# EAGLE design adns600_board_2k11 (EAGLE 5.06)
REF_FN: 1466611
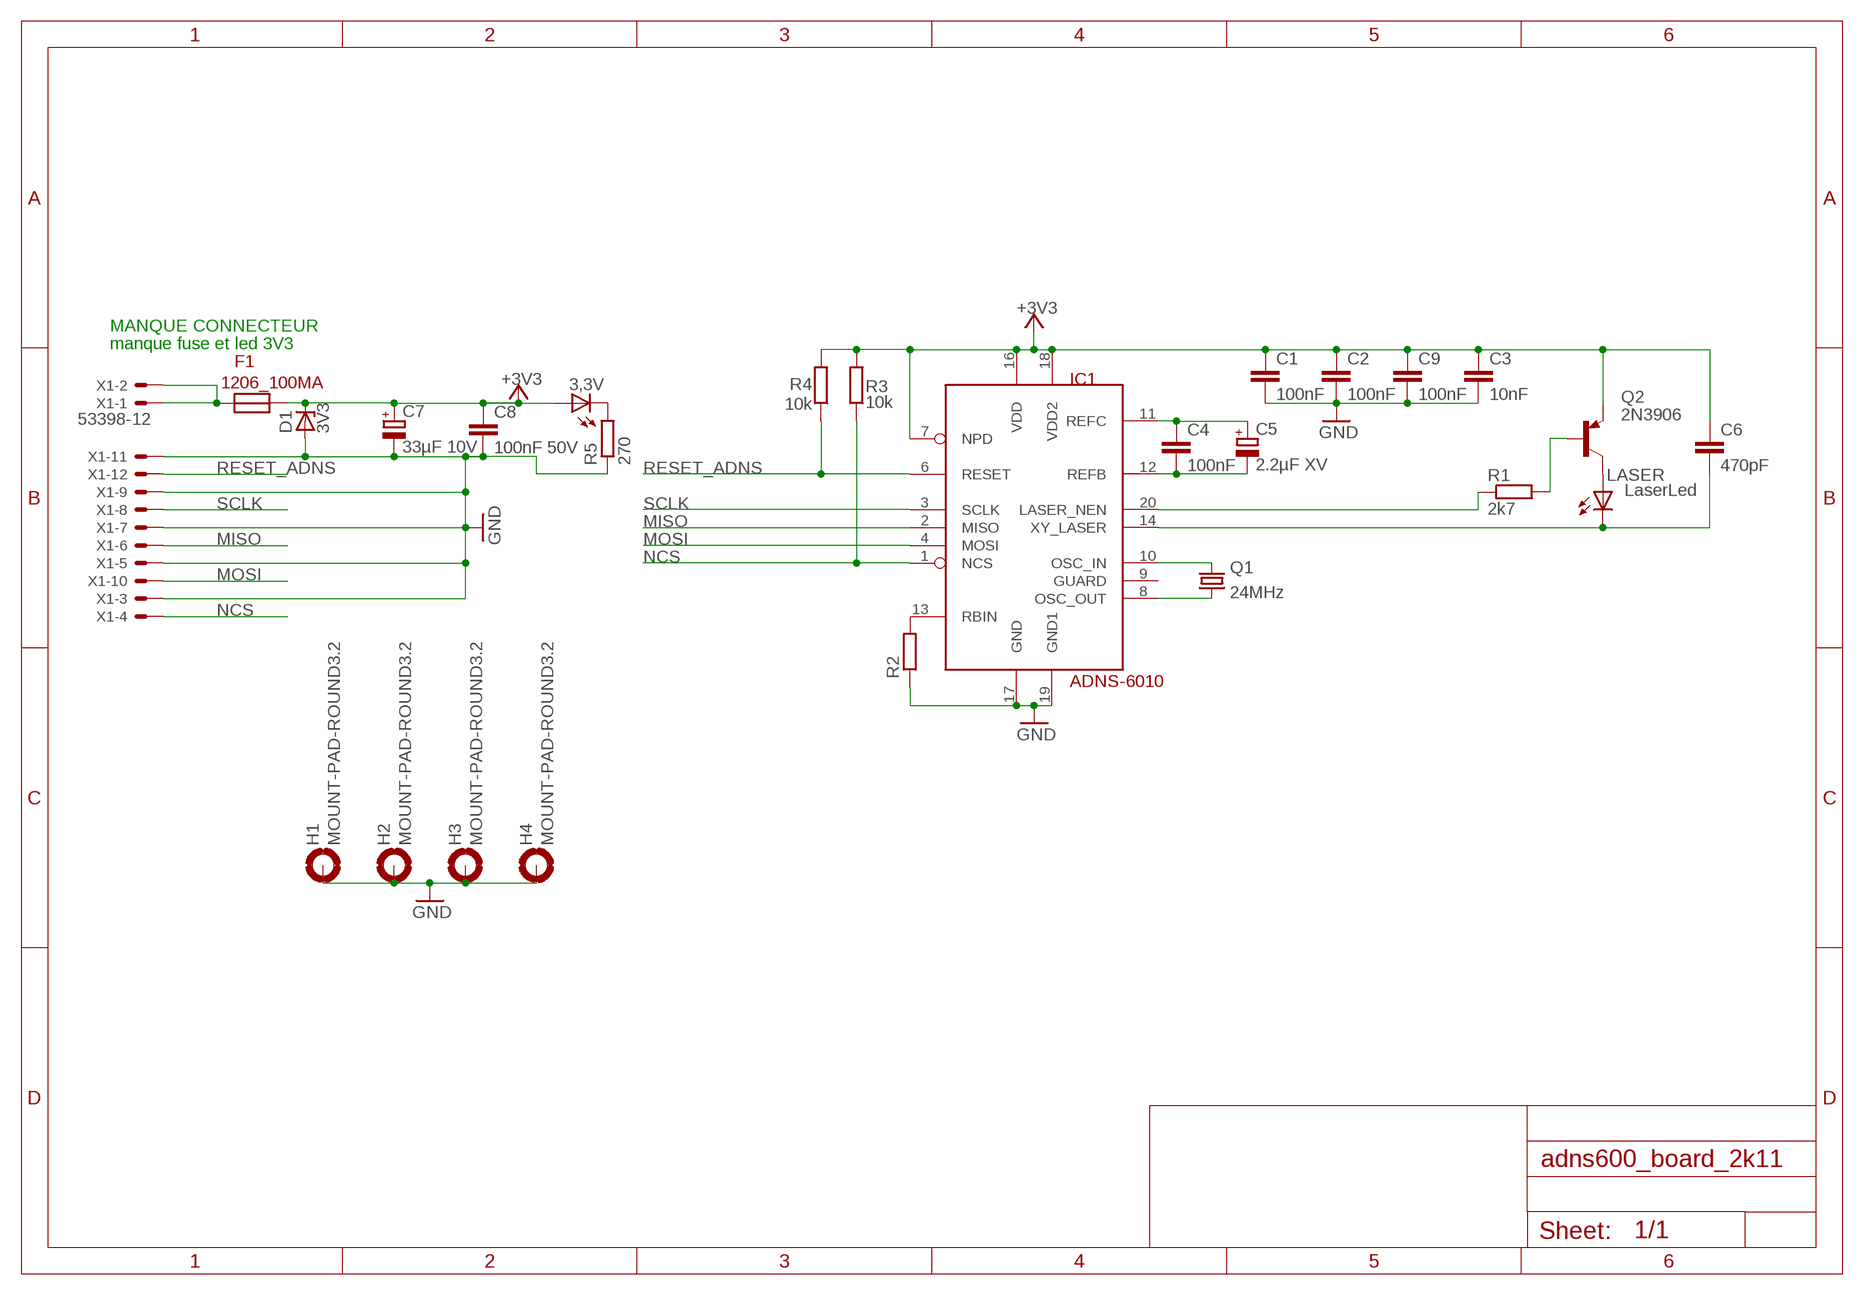
[diagram p0: schematic, sheet 1]

## Parts
3,3V  LEDCHIPLED_0805  [CHIPLED_0805]
C1  100nF  C-EUC0805  [C0805]
C2  100nF  C-EUC0805  [C0805]
C3  10nF  C-EUC0805  [C0805]
C4  100nF  C-EUC0805  [C0805]
C5  2.2µF XV  CPOL-EUSMCA  [SMC_A]
C6  470pF  C-EUC0805  [C0805]
C7  33µF 10V  CPOL-EUSMCC  [SMC_C]
C8  100nF 50V  C-EUC0805  [C0805]
C9  100nF  C-EUC0805  [C0805]
D1  3V3  ZENER-DIODESOT23  [SOT23]
F1  1206_100MA  [R1206W]
H1  MOUNT-PAD-ROUND3.2  [3,2-PAD]
H2  MOUNT-PAD-ROUND3.2  [3,2-PAD]
H3  MOUNT-PAD-ROUND3.2  [3,2-PAD]
H4  MOUNT-PAD-ROUND3.2  [3,2-PAD]
IC1  ADNS-6010  [ADNS-6010]
LASER  LaserLed  LED3MM  [LED3MM]
Q1  24MHz  CRYSTALSM49  [SM49]
Q2  2N3906  [TO92]
R1  2k7  R-EU_R0805  [R0805]
R2  R-EU_R0805  [R0805]
R3  10k  R-EU_R0805  [R0805]
R4  10k  R-EU_R0805  [R0805]
R5  270  R-EU_R0805  [R0805]
X1  53398-12  [53398-12]

## Nets
+3V3: 3,3V.A C1.1 C2.1 C3.1 C6.1 C7.+ C8.1 C9.1 D1.3(C) F1.2 IC1.7(NPD) IC1.16(VDD) IC1.18(VDD2) Q2.3(E) R3.2 R4.2
GND: C1.2 C2.2 C3.2 C7.- C8.2 C9.2 D1.1(A) H1.B3,2(MOUNT) H2.B3,2(MOUNT) H3.B3,2(MOUNT) H4.B3,2(MOUNT) IC1.17(GND) IC1.19(GND1) R2.1 R5.1 X1.3 X1.5 X1.7 X1.9 X1.11
MISO: IC1.2(MISO) X1.6
MOSI: IC1.4(MOSI) X1.10
N$1: IC1.10(OSC_IN) Q1.2
N$2: C4.1 C5.+ IC1.11(REFC)
N$3: C4.2 C5.- IC1.12(REFB)
N$4: IC1.8(OSC_OUT) Q1.1
N$5: Q2.2(B) R1.2
N$6: IC1.13(RBIN) R2.2
N$8: 3,3V.C R5.2
N$9: F1.1 X1.1 X1.2
N$13: IC1.20(LASER_NEN) R1.1
N$14: LASER.A Q2.1(C)
N$15: C6.2 IC1.14(XY_LASER) LASER.K(C)
NCS: IC1.1(NCS) R3.1 X1.4
RESET_ADNS: IC1.6(RESET) R4.1 X1.12
SCLK: IC1.3(SCLK) X1.8
Unconnected: IC1.9(GUARD)

## Notes on the sheet
- MANQUE CONNECTEUR
- manque fuse et led 3V3

## Library data of the parts
3,3V LASER = led:LED: LED OSRAM: - CHIPLED LG R971, LG N971, LY N971, LG Q971, LY Q971, LO R971, LY R971 LH N974, LH R974 LS Q976, LO Q976, LY Q976 LO Q996 - Hyper CHIPLED LW Q18S LB Q993, LB Q99A, LB R99A - SideLED LS A670, LO A670, LY A670, LG A670, LP A670 LB A673, LV A673, LT A673, LW A673 LH A674 LY A675 LS A676, LA A676, LO A676, LY A676, LW A676 LS A679, LY A679, LG A679 - Hyper Micro SIDELED® LS Y876, LA Y876, LO Y876, LY Y876 LT Y87S - SmartLED LW L88C, LW L88S LB L89C, LB L89S, LG L890 LS L89K, LO L89K, LY L89K LS L896, LA L896, LO L896, LY L896 - TOPLED LS T670, LO T670, LY T670, LG T670, LP T670 LSG T670, LSP T670, LSY T670, LOP T670, LYG T670 LG T671, LOG T671, LSG T671 LB T673, LV T673, LT T673, LW T673 LH T674 LS T676, LA T676, LO T676, LY T676, LB T676, LH T676, LSB T676, LW T676 LB T67C, LV T67C, LT T67C, LS T67K, LO T67K, LY T67K, LW E67C LS E67B, LA E67B, LO E67B, LY E67B, LB E67C, LV E67C, LT E67C LW T67C LS T679, LY T679, LG T679 LS T770, LO T770, LY T770, LG T770, LP T770 LB T773, LV T773, LT T773, LW T773 LH T774 LS E675, LA E675, LY E675, LS T675 LS T776, LA T776, LO T776, LY T776, LB T776 LHGB T686 LT T68C, LB T68C - Hyper Mini TOPLED® LB M676 - Mini TOPLED Santana® LG M470 LS M47K, LO M47K, LY M47K Source: http://www.osram.convergy.de LUXEON: - LUMILED® LXK2-PW12-R00, LXK2-PW12-S00, LXK2-PW14-U00, LXK2-PW14-V00 LXK2-PM12-R00, LXK2-PM12-S00, LXK2-PM14-U00 LXK2-PE12-Q00, LXK2-PE12-R00, LXK2-PE12-S00, LXK2-PE14-T00, LXK2-PE14-U00 LXK2-PB12-K00, LXK2-PB12-L00, LXK2-PB12-M00, LXK2-PB14-N00, LXK2-PB14-P00, LXK2-PB14-Q00 LXK2-PR12-L00, LXK2-PR12-M00, LXK2-PR14-Q00, LXK2-PR14-R00 LXK2-PD12-Q00, LXK2-PD12-R00, LXK2-PD12-S00 LXK2-PH12-R00, LXK2-PH12-S00 LXK2-PL12-P00, LXK2-PL12-Q00, LXK2-PL12-R00 Source: www.luxeon.com KINGBRIGHT: KA-3528ASYC Source: www.kingbright.com
C1-C4 C6 C8 C9 = rcl:C-EU: CAPACITOR, European symbol
C5 C7 = rcl:CPOL-EU: POLARIZED CAPACITOR, European symbol
D1 = diode:ZENER-DIODE: Z-Diode
F1 = robotter_fuses:1206_100MA; REF_FN: 1596521
H1-H4 = holes:MOUNT-PAD-ROUND: MOUNTING PAD, round
IC1 = robotter:ADNS-6010
Q1 = crystal:CRYSTAL: CRYSTAL
Q2 = transistor-pnp:2N3906: PNP Transistor
R1-R5 = rcl:R-EU_: RESISTOR, European symbol
X1 = con-molex:53?-12: CONNECTOR wire to board 1.25 mm (.049 inch) pitch header

## Board
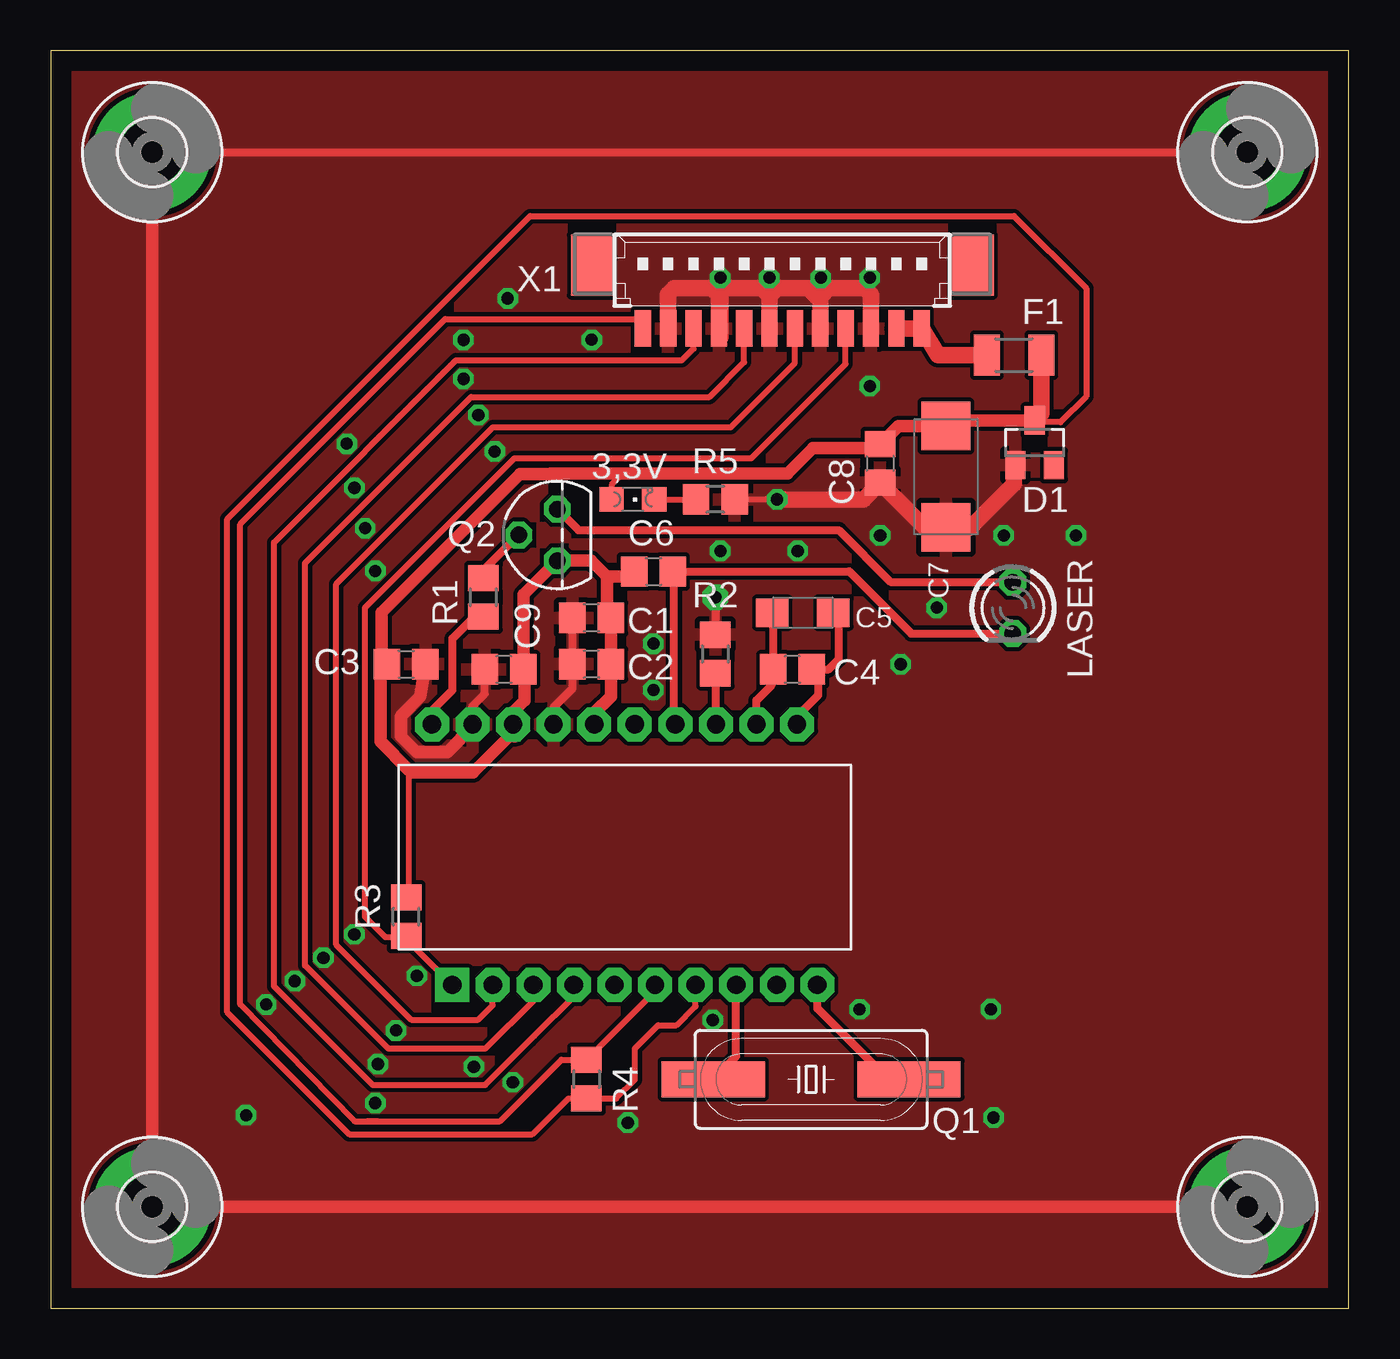
[diagram p1: board, top side]
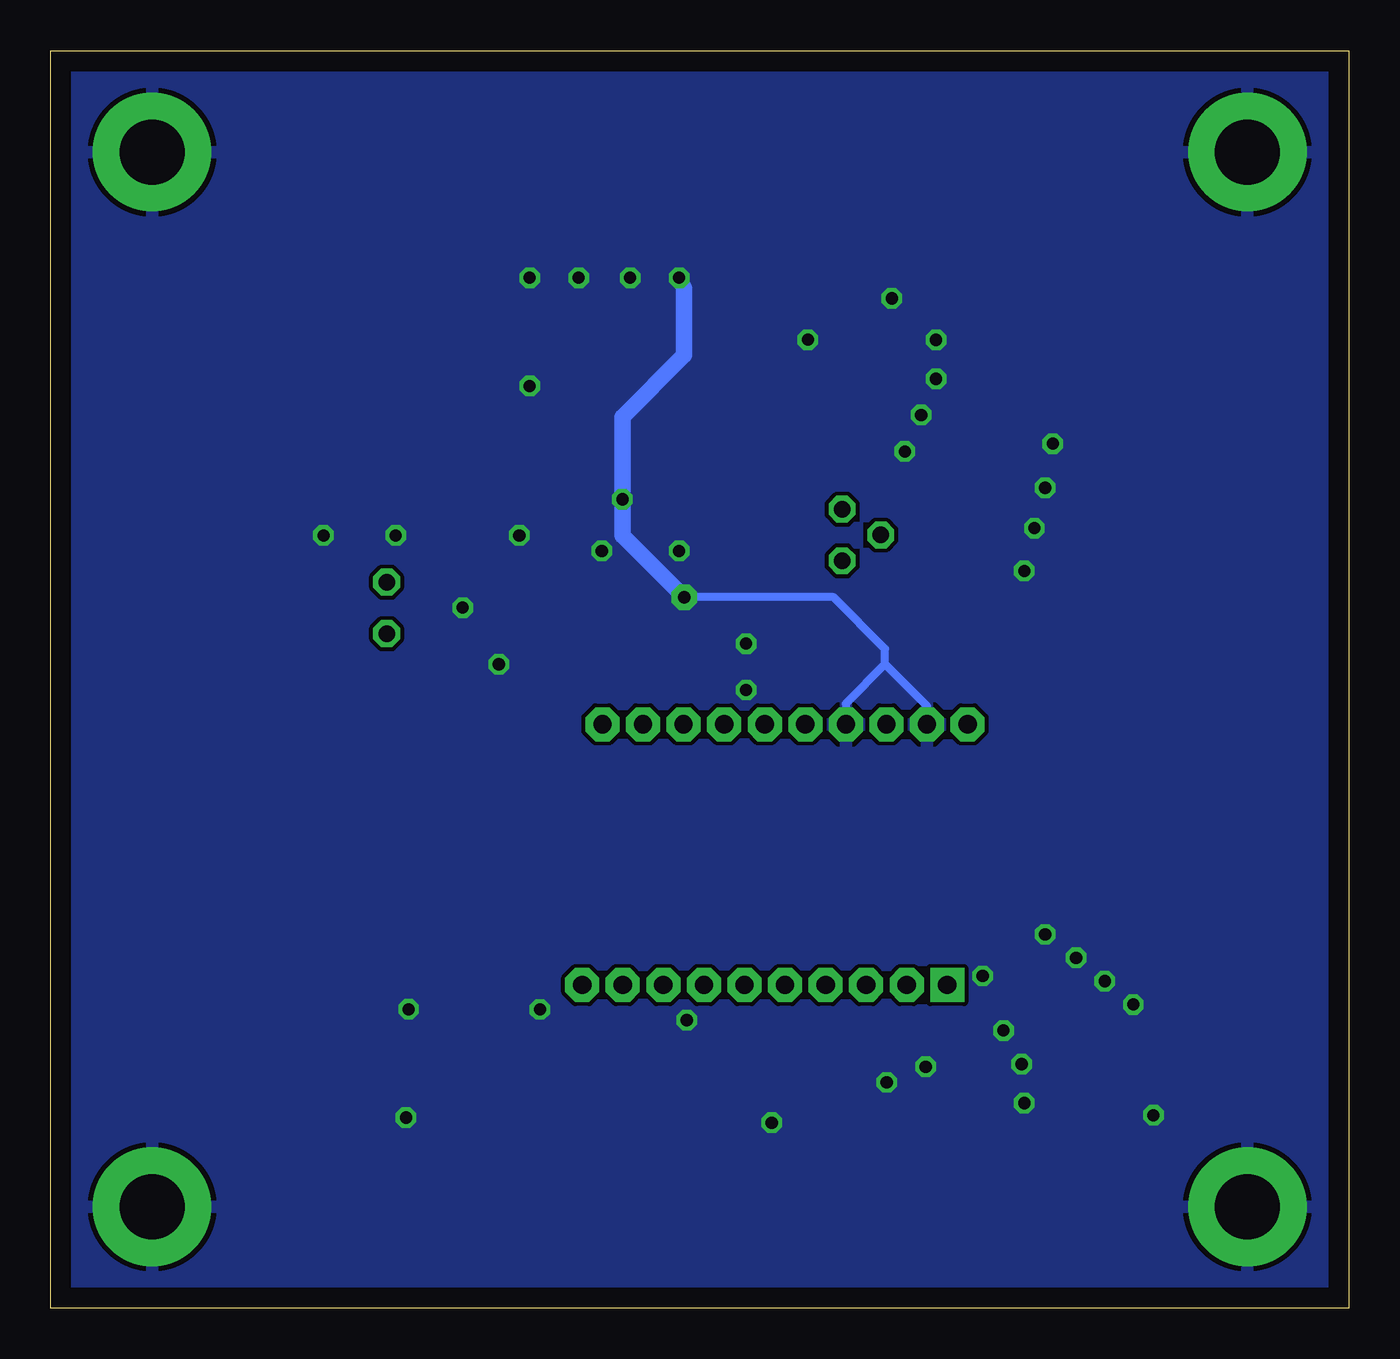
[diagram p2: board, bottom side, seen from below]

Size 64 x 62 mm. Coordinates in mm from the lower left corner, seen from the top.
Outline: 0,0 64,0 64,62 0,62 0,0
Copper layers (1*16): Top 0.035mm / dielectric 1.5mm / Bottom 0.035mm
Design rules "default *": minimum track width 10mil, minimum drill 0.6mm, track to track 8mil, track to pad 8mil, pad to pad 8mil, via to via 8mil, smd to smd 8mil, copper to edge 40mil, drill to drill 8mil, minimum pad ring 10mil, minimum via ring 8mil, stop-mask expansion 4mil, vias tented up to drill 0mil, thermal gap 10mil
tKeepout: 4 lines
bKeepout: 4 lines

### Footprints (pad centres in the part's own frame; a part is rotated, then mirrored left to right if it is on the bottom)
CHIPLED_0805 = smd 1.2 x 1.2: A 0,-1.05; C 0,1.05
C0805 = smd 1.3 x 1.5: 1 -0.95,0; 2 0.95,0
SMC_A = smd 1.6 x 1.4: + -1.5,0; - 1.5,0
SMC_C = smd 2.4 x 2.4: + -2.5,0; - 2.5,0
SOT23 = smd 1 x 1.4: 1 -0.95,-1.1; 2 0.95,-1.1; 3 0,1.1
R1206W = smd 1.27 x 2.032: 1 -1.346,0; 2 1.346,0
3,2-PAD = drill 3.2 pad 5.842 round: B3,2 0,0
ADNS-6010 = drill 0.9 pad 1.676 square: 1 -18.49,-6.3 | drill 0.9 pad 1.676 octagon: 2 -16.49,-6.3; 3 -14.49,-6.3; 4 -12.49,-6.3; 5 -10.49,-6.3; 6 -8.49,-6.3; 7 -6.49,-6.3; 8 -4.49,-6.3; 9 -2.49,-6.3; 10 -0.49,-6.3; 11 -1.49,6.55; 12 -3.49,6.55; 13 -5.49,6.55; 14 -7.49,6.55; 15 -9.49,6.55; 16 -11.49,6.55; 17 -13.49,6.55; 18 -15.49,6.55; 19 -17.49,6.55; 20 -19.49,6.55
LED3MM = drill 0.813 octagon: A -1.27,0; K 1.27,0
SM49 = smd 5.08 x 1.778: 1 -4.826,0; 2 4.826,0
TO92 = drill 0.813 octagon: 1 1.27,0; 2 0,1.905; 3 -1.27,0
R0805 = smd 1.3 x 1.5: 1 -0.95,0; 2 0.95,0
53398-12 = smd 0.8 x 1.8: 1 6.875,-2.5; 2 5.625,-2.5; 3 4.375,-2.5; 4 3.125,-2.5; 5 1.875,-2.5; 6 0.625,-2.5; 7 -0.625,-2.5; 8 -1.875,-2.5; 9 -3.125,-2.5; 10 -4.375,-2.5; 11 -5.625,-2.5; 12 -6.875,-2.5 | smd 2.1 x 3: S1 9.375,0.625; S2 -9.375,0.625

### Placement (x,y rotation side)
3,3V  28.7,39.88 270 top
C1  26.67,34.04 180 top
C2  26.67,31.75 180 top
C3  17.53,31.75 0 top
C4  36.58,31.5 180 top
C5  37.08,34.29 180 top
C6  29.72,36.32 0 top
C7  44.14,41 270 top
C8  40.89,41.66 270 top
C9  22.35,31.5 180 top
D1  48.51,42.67 0 top
F1  47.5,46.99 0 top
H1  5,57 0 top
H2  5,5 0 top
H3  59,5 0 top
H4  59,57 0 top
IC1  38.29,22.24 0 top
LASER  47.43,34.53 270 top
Q1  37.49,11.29 0 top
Q2  24.98,38.12 90 top
R1  21.34,35.05 90 top
R2  32.77,32.26 270 top
R3  17.53,19.3 90 top
R4  26.42,11.3 270 top
R5  32.77,39.88 180 top
X1  36.07,50.8 0 top

### Tracks (layer width: path | path; a pad name or v marks a point on that pad's centre or on a via)
+3V3
  Top 0.305: R3.2 17.65,20.38 17.65,26.54 | D1.3 48.6,43.69 49.78,43.69 51.05,44.96 51.05,50.29 47.5,53.85 23.64,53.85 8.7,38.91 8.7,14.59 14.72,8.58 23.75,8.58 25.52,10.35 R4.2 27.88,10.35 28.8,11.26 28.8,12.8 29.95,13.95 30.85,13.95 31.74,14.85 31.8,14.9 IC1.7 | 3,3V.A 27.65,40.61 28.19,41.15
  Top 0.61: 22.86,28.19 22.8,28.26 IC1.18 | IC1.18 22.8,29.4 23.37,29.97 23.37,31.43 C9.1 23.3,35.18 Q2.3 26.65,36.85 27.43,36.07 | 27.43,36.07 27.43,34.22 C1.1 C2.1 27.62,30.16 26.8,29.34 IC1.16 | 27.43,36.07 28.77,36.07 C6.1 | IC1.18 22.61,28.19 20.83,26.42 17.78,26.42 17.65,26.54 16.26,27.94 16.26,31.75 C3.1 16.32,32 16.32,34.29 23.15,41.12 24.61,41.12 24.64,41.15 28.19,41.15 36.32,41.15 37.59,42.42 40.51,42.42 40.79,42.71 C8.1 41.79,43.5 C7.+ | D1.3 44.41,43.77
  Top 0.813: 44.41,43.77 C7.+ | F1.2 48.84,44.1 D1.3
GND  (via drill 0.6, 0.6 pad 0.61, 0.6 pad 0.7, 0.6 pad 1.27)
  Top 0.305: v35.81,39.88 R5.1
  Top 0.406: C1.2 C2.2 25.72,30.55 24.8,29.62 IC1.17 | v32.77,35.05 R2.1 | H1.B3,2 H4.B3,2 | C9.2 21.4,30.29 20.8,29.69 IC1.19 | C3.2 18.03,31.68
  Top 0.61: 20.83,28.76 IC1.19 20.8,28.67 19.56,27.43 18.03,27.43 17.27,28.19 17.27,29.21 18.22,30.16 C3.2 18.29,32.07 | H3.B3,2 H2.B3,2 H1.B3,2
  Top 0.813: C8.2 43.1,38.5 C7.- 45.36,38.5 47.5,40.64 47.5,41.51 D1.1 | 37.94,49.88 X1.5 | 37.94,49.88 38.35,50.3 40.13,50.3 40.44,49.98 X1.3 | 35.44,49.91 35.05,50.3 33.27,50.3 32.94,49.97 | 32.94,49.97 X1.9 33.02,47.87 v33.02,50.81 | 32.94,49.97 32.61,50.3 30.73,50.3 30.44,50.01 X1.11 | 35.44,49.91 35.83,50.3 37.34,50.3 37.75,49.88 37.94,49.88 | 35.44,49.91 X1.7 | C8.2 40.83,40.64 | v35.81,39.88 40.07,39.88 C8.2
  Bottom 0.406: IC1.19 20.8,29.69 22.86,31.75 | 24.8,29.56 IC1.17 24.8,29.81 22.86,31.75 | 22.86,31.75 22.86,32.51 25.4,35.05 v32.77,35.05
  Bottom 0.813: v33.02,50.81 32.77,50.3 32.77,46.99 35.81,43.94 v35.81,39.88 35.81,38.1 v32.77,35.05
  other vias: 21.08,44.04 26.67,47.75 15.5,38.46 40.89,38.1 41.91,31.75 43.69,34.54 46.99,38.1 50.55,38.1 28.45,9.14 46.48,9.4 46.35,14.74 29.72,32.77 29.72,30.48 36.83,37.34 33.02,37.34 39.88,14.73 35.43,50.81 37.97,50.81 40.39,50.81 40.39,45.47 9.63,9.51 21.89,42.24 16,36.35 20.35,45.82 14.98,40.45 14.59,42.62 20.35,47.74 22.53,49.79 14.98,18.43 18.05,16.38 13.44,17.28 17.02,13.7 12.03,16.13 20.86,11.9 10.62,14.98 16,10.11 16.13,12.03 22.78,11.14 32.64,14.21
  pour Top: 0,0 64.01,0 64.01,61.98 0,61.98
  pour Bottom: 0,0 0,61.98 64.01,61.98 64.01,0
MISO
  Top 0.305: IC1.2 21.8,14.94 21.08,14.22 17.78,14.22 14.08,17.92 14.08,35.71 21.8,43.43 33.53,43.43 36.69,46.6 X1.6
MOSI
  Top 0.305: IC1.4 25.8,15.38 23.83,13.42 | 23.83,13.42 23.62,13.21 | X1.10 31.69,47.31 31.12,46.74 19.98,46.74 11.01,37.76 11.01,15.87 15.87,11.01 21.42,11.01 23.83,13.42
N$1
  Top 0.406: IC1.10 37.8,14.78 41.4,11.18 42.2,11.18 Q1.2
N$2
  Top 0.406: IC1.11 36.8,29.18 37.85,30.23 37.85,31.18 C4.1 38.35,31.5 38.86,32 38.86,34.01 C5.+
N$3
  Top 0.406: IC1.12 34.8,29.97 35.56,30.73 35.56,31.43 C4.2 35.63,34.25 C5.-
N$4
  Top 0.406: Q1.1 33.8,12.42 IC1.8
N$5
  Top 0.406: R1.2 21.34,36.38 Q2.2
N$6
  Top 0.406: IC1.13 32.8,31.28 R2.2
N$8
  Top 0.305: 3,3V.C R5.2
N$9
  Top 0.813: F1.1 43.74,46.99 X1.1 X1.2
N$13
  Top 0.406: R1.1 20.89,34.1 19.81,33.02 19.81,30.48 18.8,29.46 IC1.20
N$14
  Top 0.406: Q2.1 26.02,38.35 38.86,38.35 41.4,35.81 47.42,35.81 LASER.A
N$15
  Top 0.406: IC1.14 30.73,28.85 30.73,36.26 C6.2 39.37,36.32 42.43,33.26 LASER.K
NCS
  Top 0.305: IC1.1 17.53,18.21 17.53,18.29 | R3.1 17.53,18.29 | 17.53,18.29 16.51,18.29 15.49,19.3 15.49,34.54 22.86,41.91 34.54,41.91 39.19,46.56 X1.4
RESET_ADNS
  Top 0.305: X1.12 29.19,48.75 29.21,48.77 19.46,48.77 9.34,38.66 9.34,14.98 14.98,9.22 16.13,9.22 | 16.13,9.22 15.62,9.22 | 16.13,9.22 22.14,9.22 25.17,12.25 R4.1 29.8,15.63 IC1.6
SCLK
  Top 0.305: IC1.3 23.8,15.16 21.44,12.8 17.15,12.8 16.64,12.8 12.54,16.9 12.54,36.74 14.66,38.85 | X1.8 34.19,46.64 32.48,44.93 20.74,44.93 14.66,38.85 | 14.66,38.85 14.48,38.67